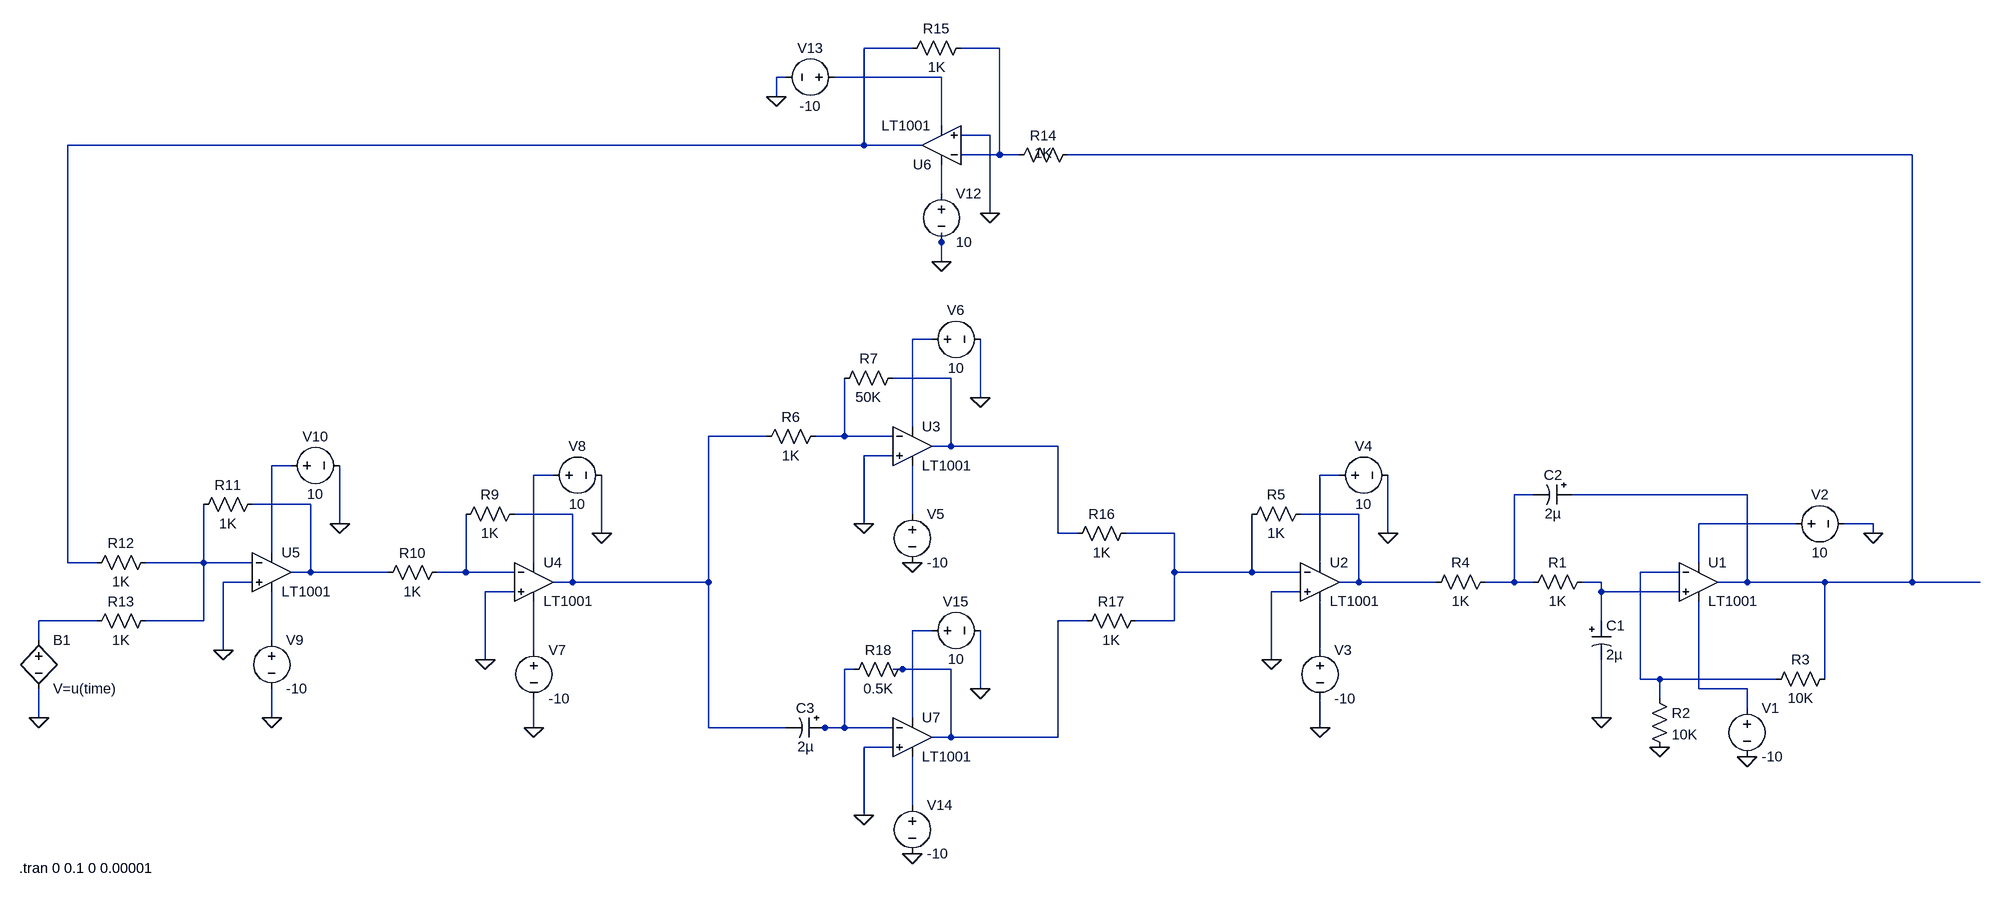
[diagram p0: schematic PD_controller.asc]
PD_controller.asc, the LTspice schematic file:
Version 4
SHEET 1 2020 1608
WIRE 256 240 176 240
WIRE 400 240 336 240
WIRE 48 288 32 288
WIRE 304 288 128 288
WIRE 32 320 32 288
WIRE 304 368 304 288
WIRE 384 384 336 384
WIRE 176 400 176 240
WIRE 176 400 -1136 400
WIRE 272 400 176 400
WIRE 400 416 400 240
WIRE 400 416 336 416
WIRE 432 416 400 416
WIRE 1904 416 512 416
WIRE 304 480 304 432
WIRE 384 512 384 384
WIRE 304 560 304 544
WIRE 304 592 304 560
WIRE 288 720 256 720
WIRE 320 784 224 784
WIRE 368 816 368 720
WIRE 256 864 256 720
WIRE 16 880 -80 880
WIRE 144 880 144 784
WIRE 144 880 96 880
WIRE 224 880 144 880
WIRE 320 896 320 784
WIRE 320 896 288 896
WIRE 496 896 320 896
WIRE 224 912 176 912
WIRE -768 928 -800 928
WIRE -336 944 -368 944
WIRE 960 944 928 944
WIRE 1280 976 1248 976
WIRE 1632 976 1344 976
WIRE -736 992 -832 992
WIRE -304 1008 -400 1008
WIRE 256 1008 256 928
WIRE 992 1008 896 1008
WIRE -688 1024 -688 928
WIRE 176 1024 176 912
WIRE 1712 1024 1552 1024
WIRE 1840 1024 1792 1024
WIRE -256 1040 -256 944
WIRE 496 1040 496 896
WIRE 528 1040 496 1040
WIRE 688 1040 608 1040
WIRE 1040 1040 1040 944
WIRE 1840 1040 1840 1024
WIRE -800 1072 -800 928
WIRE -1136 1088 -1136 400
WIRE -1088 1088 -1136 1088
WIRE -912 1088 -912 992
WIRE -912 1088 -1008 1088
WIRE -832 1088 -912 1088
WIRE -368 1088 -368 944
WIRE 928 1088 928 944
WIRE 1552 1088 1552 1024
WIRE -736 1104 -736 992
WIRE -736 1104 -768 1104
WIRE -608 1104 -736 1104
WIRE -480 1104 -480 1008
WIRE -480 1104 -528 1104
WIRE -400 1104 -480 1104
WIRE 688 1104 688 1040
WIRE 816 1104 816 1008
WIRE 816 1104 688 1104
WIRE 896 1104 816 1104
WIRE 1520 1104 1456 1104
WIRE -832 1120 -880 1120
WIRE -304 1120 -304 1008
WIRE -304 1120 -336 1120
WIRE -80 1120 -80 880
WIRE -80 1120 -304 1120
WIRE 992 1120 992 1008
WIRE 992 1120 960 1120
WIRE 1120 1120 992 1120
WIRE 1248 1120 1248 976
WIRE 1248 1120 1200 1120
WIRE 1280 1120 1248 1120
WIRE 1392 1120 1360 1120
WIRE 1632 1120 1632 976
WIRE 1632 1120 1584 1120
WIRE 1760 1120 1632 1120
WIRE 1904 1120 1904 416
WIRE 1904 1120 1760 1120
WIRE 2016 1120 1904 1120
WIRE -400 1136 -448 1136
WIRE 896 1136 848 1136
WIRE 1392 1136 1392 1120
WIRE 1520 1136 1392 1136
WIRE -1088 1184 -1184 1184
WIRE -912 1184 -912 1088
WIRE -912 1184 -1008 1184
WIRE 544 1184 496 1184
WIRE 688 1184 688 1104
WIRE 688 1184 624 1184
WIRE 1392 1184 1392 1136
WIRE 288 1200 256 1200
WIRE -1184 1216 -1184 1184
WIRE -800 1216 -800 1136
WIRE -880 1232 -880 1120
WIRE -368 1232 -368 1152
WIRE 928 1232 928 1152
WIRE -448 1248 -448 1136
WIRE 848 1248 848 1136
WIRE 160 1264 144 1264
WIRE 240 1264 224 1264
WIRE 320 1264 240 1264
WIRE 1456 1280 1456 1104
WIRE 1488 1280 1456 1280
WIRE 1680 1280 1488 1280
WIRE 1760 1280 1760 1120
WIRE 368 1296 368 1200
WIRE 1552 1296 1552 1152
WIRE 1632 1296 1552 1296
WIRE 1488 1312 1488 1280
WIRE 1632 1328 1632 1296
WIRE -1184 1344 -1184 1296
WIRE -800 1344 -800 1296
WIRE 256 1344 256 1200
WIRE 1392 1344 1392 1248
WIRE -368 1360 -368 1312
WIRE -80 1360 -80 1120
WIRE 48 1360 -80 1360
WIRE 112 1360 96 1360
WIRE 144 1360 144 1264
WIRE 144 1360 112 1360
WIRE 224 1360 144 1360
WIRE 928 1360 928 1312
WIRE 320 1376 320 1264
WIRE 320 1376 288 1376
WIRE 496 1376 496 1184
WIRE 496 1376 320 1376
WIRE 224 1392 176 1392
WIRE 256 1488 256 1408
WIRE 176 1504 176 1392
FLAG 1488 1392 0
FLAG 1392 1344 0
FLAG 1632 1408 0
FLAG 1840 1040 0
FLAG 1040 1040 0
FLAG 928 1360 0
FLAG 848 1248 0
FLAG 368 816 0
FLAG 256 1088 0
FLAG 176 1024 0
FLAG -256 1040 0
FLAG -368 1360 0
FLAG -448 1248 0
FLAG -688 1024 0
FLAG -800 1344 0
FLAG -880 1232 0
FLAG -1184 1344 0
FLAG 304 592 0
FLAG 32 320 0
FLAG 368 1296 0
FLAG 256 1568 0
FLAG 176 1504 0
FLAG 384 512 0
SYMBOL voltage 1632 1312 R0
WINDOW 123 0 0 Left 0
WINDOW 39 0 0 Left 0
SYMATTR InstName V1
SYMATTR Value -10
SYMBOL voltage 1696 1024 R270
WINDOW 0 32 56 VTop 2
WINDOW 3 -32 56 VBottom 2
WINDOW 123 0 0 Left 0
WINDOW 39 0 0 Left 0
SYMATTR InstName V2
SYMATTR Value 10
SYMBOL res 1376 1104 R90
WINDOW 0 0 56 VBottom 2
WINDOW 3 32 56 VTop 2
SYMATTR InstName R1
SYMATTR Value 1K
SYMBOL polcap 1376 1184 R0
SYMATTR InstName C1
SYMATTR Value 2µ
SYMBOL polcap 1344 960 R90
WINDOW 0 0 32 VBottom 2
WINDOW 3 32 32 VTop 2
SYMATTR InstName C2
SYMATTR Value 2µ
SYMBOL OpAmps\\LT1001 1552 1056 R0
SYMATTR InstName U1
SYMBOL res 1472 1296 R0
SYMATTR InstName R2
SYMATTR Value 10K
SYMBOL res 1776 1264 R90
WINDOW 0 0 56 VBottom 2
WINDOW 3 32 56 VTop 2
SYMATTR InstName R3
SYMATTR Value 10K
SYMBOL OpAmps\\LT1001 928 1056 R0
SYMATTR InstName U2
SYMBOL voltage 928 1216 R0
WINDOW 123 0 0 Left 0
WINDOW 39 0 0 Left 0
SYMATTR InstName V3
SYMATTR Value -10
SYMBOL voltage 944 944 R270
WINDOW 0 32 56 VTop 2
WINDOW 3 -32 56 VBottom 2
WINDOW 123 0 0 Left 0
WINDOW 39 0 0 Left 0
SYMATTR InstName V4
SYMATTR Value 10
SYMBOL res 1216 1104 R90
WINDOW 0 0 56 VBottom 2
WINDOW 3 32 56 VTop 2
SYMATTR InstName R4
SYMATTR Value 1K
SYMBOL res 912 992 R90
WINDOW 0 0 56 VBottom 2
WINDOW 3 32 56 VTop 2
SYMATTR InstName R5
SYMATTR Value 1K
SYMBOL OpAmps\\LT1001 256 832 R0
SYMATTR InstName U3
SYMBOL voltage 256 992 R0
WINDOW 123 0 0 Left 0
WINDOW 39 0 0 Left 0
SYMATTR InstName V5
SYMATTR Value -10
SYMBOL voltage 272 720 R270
WINDOW 0 32 56 VTop 2
WINDOW 3 -32 56 VBottom 2
WINDOW 123 0 0 Left 0
WINDOW 39 0 0 Left 0
SYMATTR InstName V6
SYMATTR Value 10
SYMBOL res 112 864 R90
WINDOW 0 0 56 VBottom 2
WINDOW 3 32 56 VTop 2
SYMATTR InstName R6
SYMATTR Value 1K
SYMBOL res 240 768 R90
WINDOW 0 0 56 VBottom 2
WINDOW 3 32 56 VTop 2
SYMATTR InstName R7
SYMATTR Value 50K
SYMBOL OpAmps\\LT1001 -368 1056 R0
SYMATTR InstName U4
SYMBOL voltage -368 1216 R0
WINDOW 123 0 0 Left 0
WINDOW 39 0 0 Left 0
SYMATTR InstName V7
SYMATTR Value -10
SYMBOL voltage -352 944 R270
WINDOW 0 32 56 VTop 2
WINDOW 3 -32 56 VBottom 2
WINDOW 123 0 0 Left 0
WINDOW 39 0 0 Left 0
SYMATTR InstName V8
SYMATTR Value 10
SYMBOL res -384 992 R90
WINDOW 0 0 56 VBottom 2
WINDOW 3 32 56 VTop 2
SYMATTR InstName R9
SYMATTR Value 1K
SYMBOL OpAmps\\LT1001 -800 1040 R0
SYMATTR InstName U5
SYMBOL voltage -800 1200 R0
WINDOW 123 0 0 Left 0
WINDOW 39 0 0 Left 0
SYMATTR InstName V9
SYMATTR Value -10
SYMBOL voltage -784 928 R270
WINDOW 0 32 56 VTop 2
WINDOW 3 -32 56 VBottom 2
WINDOW 123 0 0 Left 0
WINDOW 39 0 0 Left 0
SYMATTR InstName V10
SYMATTR Value 10
SYMBOL res -512 1088 R90
WINDOW 0 0 56 VBottom 2
WINDOW 3 32 56 VTop 2
SYMATTR InstName R10
SYMATTR Value 1K
SYMBOL res -816 976 R90
WINDOW 0 0 56 VBottom 2
WINDOW 3 32 56 VTop 2
SYMATTR InstName R11
SYMATTR Value 1K
SYMBOL res -992 1072 R90
WINDOW 0 0 56 VBottom 2
WINDOW 3 32 56 VTop 2
SYMATTR InstName R12
SYMATTR Value 1K
SYMBOL res -992 1168 R90
WINDOW 0 0 56 VBottom 2
WINDOW 3 32 56 VTop 2
SYMATTR InstName R13
SYMATTR Value 1K
SYMBOL OpAmps\\LT1001 304 464 R180
SYMATTR InstName U6
SYMBOL res 528 400 R90
WINDOW 0 0 56 VBottom 2
WINDOW 3 -2 56 VTop 2
SYMATTR InstName R14
SYMATTR Value 1K
SYMBOL res 352 224 R90
WINDOW 0 0 56 VBottom 2
WINDOW 3 32 56 VTop 2
SYMATTR InstName R15
SYMATTR Value 1K
SYMBOL voltage 304 464 R0
WINDOW 123 0 0 Left 0
WINDOW 39 0 0 Left 0
SYMATTR InstName V12
SYMATTR Value 10
SYMBOL voltage 144 288 R90
WINDOW 0 -32 56 VBottom 2
WINDOW 3 32 56 VTop 2
WINDOW 123 0 0 Left 0
WINDOW 39 0 0 Left 0
SYMATTR InstName V13
SYMATTR Value -10
SYMBOL OpAmps\\LT1001 256 1312 R0
SYMATTR InstName U7
SYMBOL voltage 256 1472 R0
WINDOW 123 0 0 Left 0
WINDOW 39 0 0 Left 0
SYMATTR InstName V14
SYMATTR Value -10
SYMBOL voltage 272 1200 R270
WINDOW 0 32 56 VTop 2
WINDOW 3 -32 56 VBottom 2
WINDOW 123 0 0 Left 0
WINDOW 39 0 0 Left 0
SYMATTR InstName V15
SYMATTR Value 10
SYMBOL res 624 1024 R90
WINDOW 0 0 56 VBottom 2
WINDOW 3 32 56 VTop 2
SYMATTR InstName R16
SYMATTR Value 1K
SYMBOL res 640 1168 R90
WINDOW 0 0 56 VBottom 2
WINDOW 3 32 56 VTop 2
SYMATTR InstName R17
SYMATTR Value 1K
SYMBOL res 256 1248 R90
WINDOW 0 0 56 VBottom 2
WINDOW 3 32 56 VTop 2
SYMATTR InstName R18
SYMATTR Value 0.5K
SYMBOL polcap 112 1344 R90
WINDOW 0 0 32 VBottom 2
WINDOW 3 32 32 VTop 2
SYMATTR InstName C3
SYMATTR Value 2µ
SYMBOL bv -1184 1200 R0
SYMATTR InstName B1
SYMATTR Value V=u(time)
TEXT -1216 1592 Left 2 !.tran 0 0.1 0 0.00001

The netlist it stands for:
* PD_controller.asc
V1 N030 0 -10
V2 N017 0 10
R1 N022 N013 1K
C1 N022 0 2µ
C2 N004 N013 2µ
XU1 N022 N021 N017 N030 N004 LT1001  ; pins In+ In- V+ V- OUT
R2 N021 0 10K
R3 N004 N021 10K
XU2 0 N018 N012 N028 N016 LT1001  ; pins In+ In- V+ V- OUT
V3 N028 0 -10
V4 N012 0 10
R4 N013 N016 1K
R5 N016 N018 1K
XU3 0 N009 N006 N015 N007 LT1001  ; pins In+ In- V+ V- OUT
V5 N015 0 -10
V6 N006 0 10
R6 N009 N008 1K
R7 N007 N009 50K
XU4 0 N020 N011 N027 N008 LT1001  ; pins In+ In- V+ V- OUT
V7 N027 0 -10
V8 N011 0 10
R9 N008 N020 1K
XU5 0 N019 N010 N026 N014 LT1001  ; pins In+ In- V+ V- OUT
V9 N026 0 -10
V10 N010 0 10
R10 N020 N014 1K
R11 N014 N019 1K
R12 N019 N001 1K
R13 N019 N023 1K
XU6 0 N002 N005 N003 N001 LT1001  ; pins In+ In- V+ V- OUT
R14 N004 N002 1K
R15 N002 N001 1K
V12 N005 0 10
V13 N003 0 -10
XU7 0 N029 N025 N031 N024 LT1001  ; pins In+ In- V+ V- OUT
V14 N031 0 -10
V15 N025 0 10
R16 N018 N007 1K
R17 N018 N024 1K
R18 N024 N029 0.5K
C3 N029 N008 2µ
B1 N023 0 V=u(time)
.tran 0 0.1 0 0.00001
.lib LTC.lib
.backanno
.end